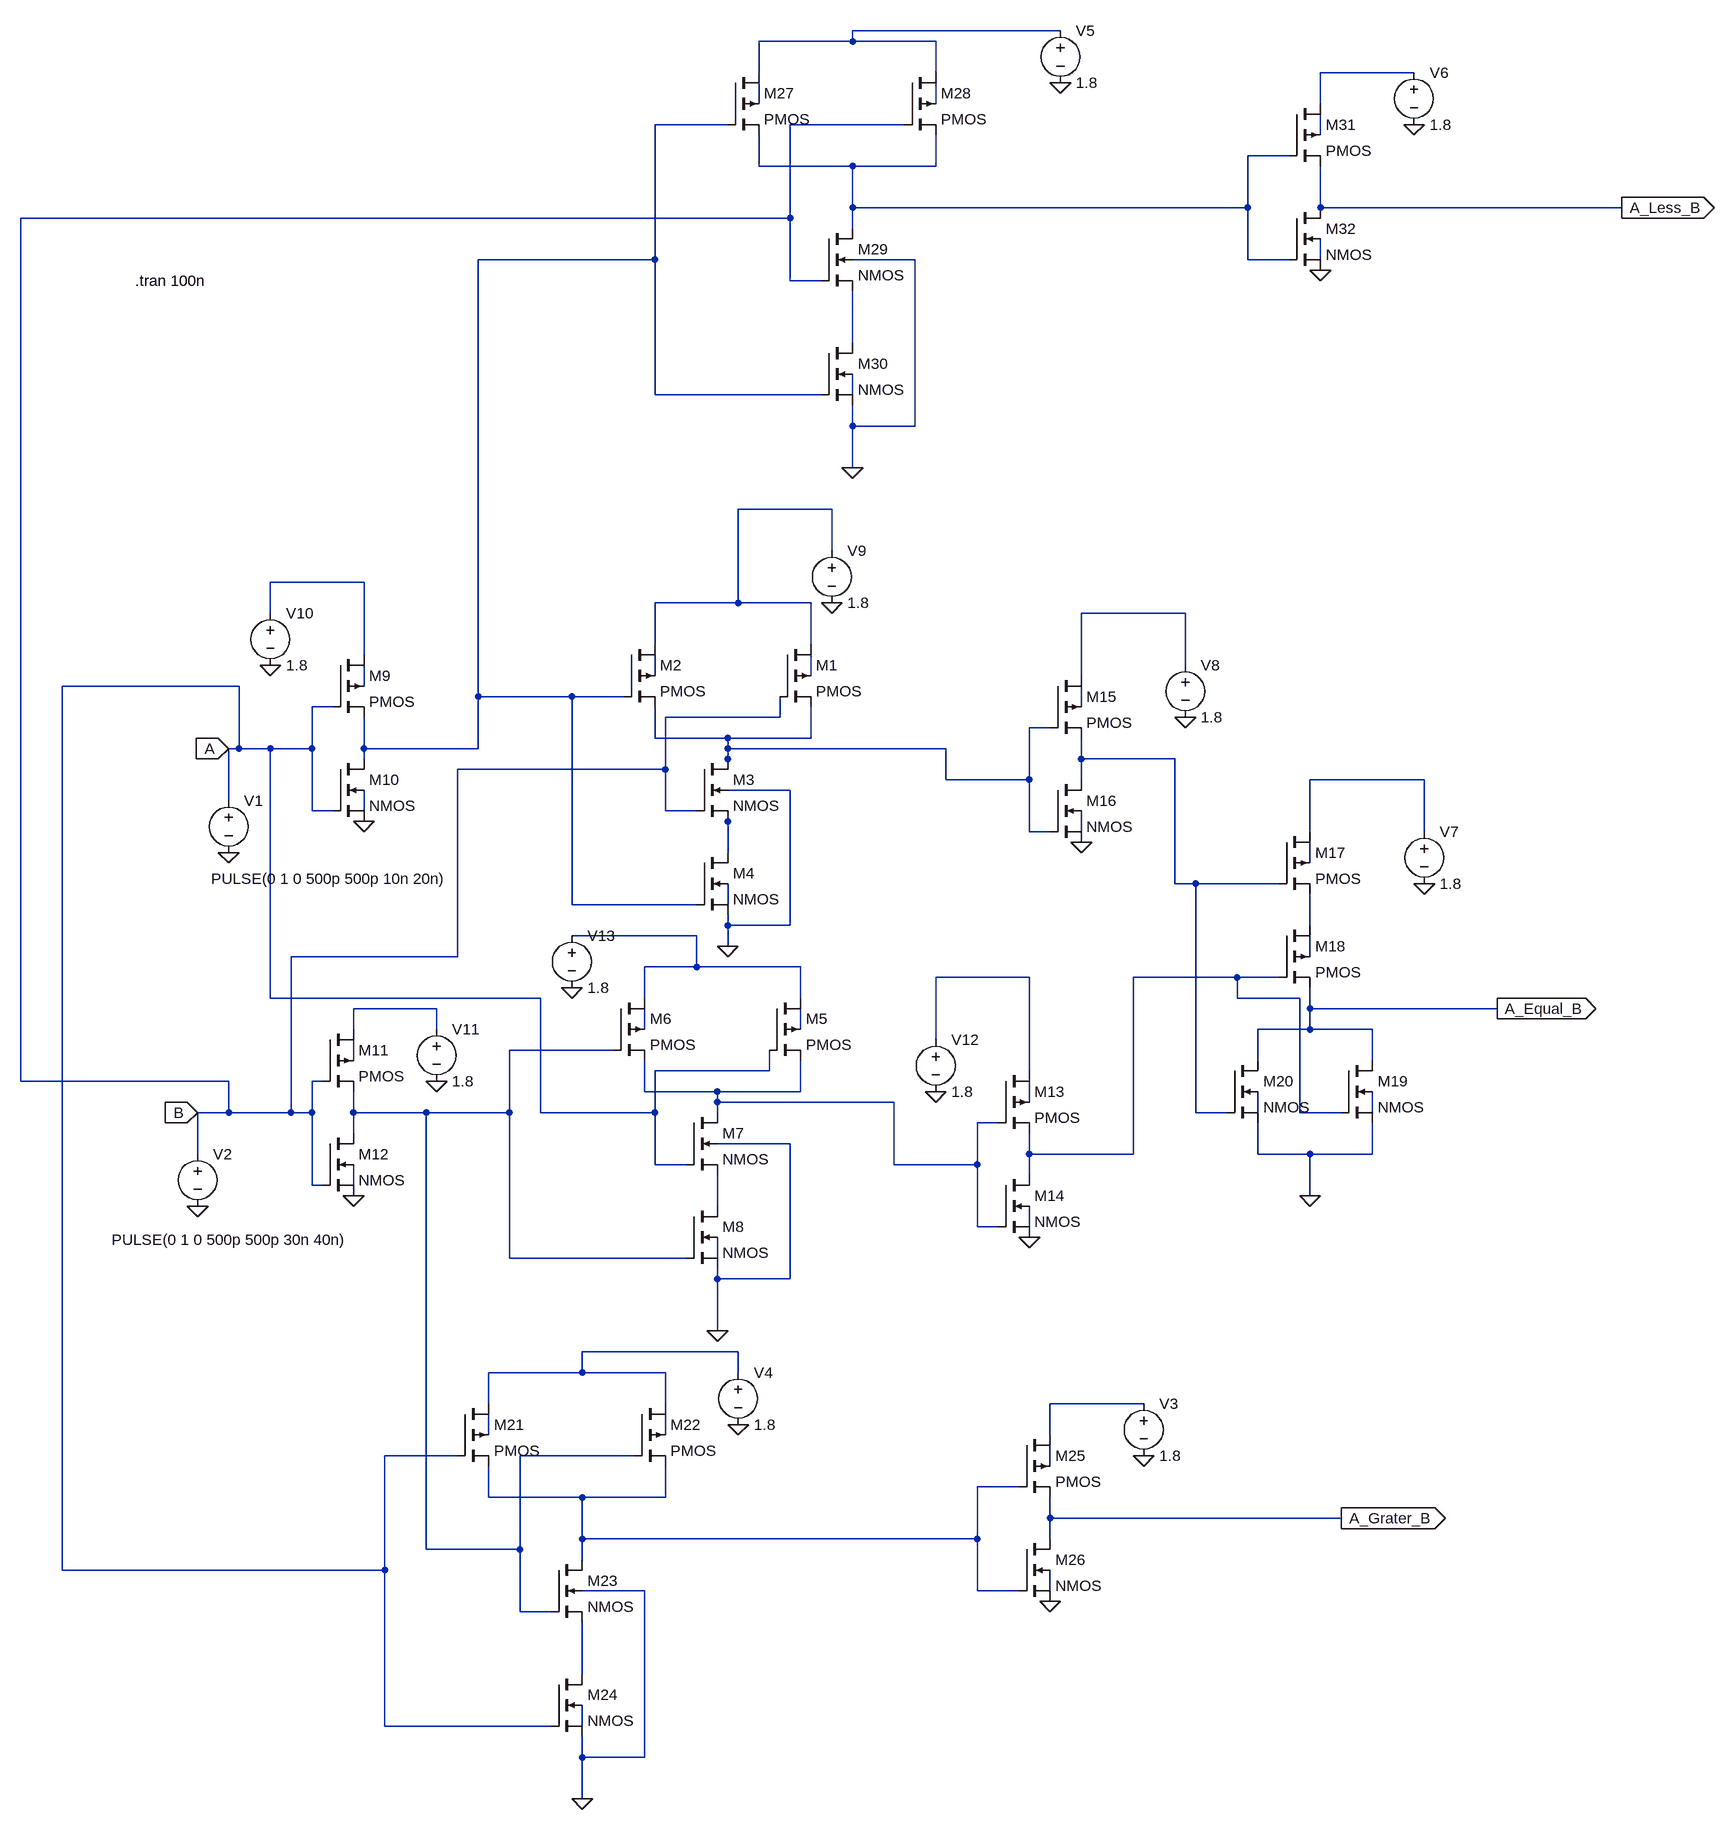
[diagram p0: schematic comparator.asc]
comparator.asc, the LTspice schematic file:
Version 4.1
SHEET 1 1784 1796
WIRE 672 -1056 352 -1056
WIRE 352 -1040 352 -1056
WIRE 352 -1040 208 -1040
WIRE 480 -1040 352 -1040
WIRE 208 -992 208 -1040
WIRE 480 -992 480 -1040
WIRE 1216 -992 1072 -992
WIRE 208 -944 208 -976
WIRE 480 -944 480 -976
WIRE 1072 -944 1072 -992
WIRE 160 -912 48 -912
WIRE 432 -912 256 -912
WIRE 1072 -896 1072 -928
WIRE 1024 -864 960 -864
WIRE 208 -848 208 -896
WIRE 352 -848 208 -848
WIRE 480 -848 480 -896
WIRE 480 -848 352 -848
WIRE 352 -784 352 -848
WIRE 960 -784 960 -864
WIRE 960 -784 352 -784
WIRE 1072 -784 1072 -848
WIRE 1536 -784 1072 -784
WIRE 256 -768 256 -912
WIRE 256 -768 -928 -768
WIRE 352 -752 352 -784
WIRE 48 -704 48 -912
WIRE 48 -704 -224 -704
WIRE 448 -704 352 -704
WIRE 960 -704 960 -784
WIRE 1024 -704 960 -704
WIRE 1072 -704 1072 -736
WIRE 256 -672 256 -768
WIRE 304 -672 256 -672
WIRE 352 -576 352 -656
WIRE 48 -496 48 -704
WIRE 304 -496 48 -496
WIRE 352 -496 352 -528
WIRE 352 -448 352 -480
WIRE 448 -448 448 -704
WIRE 448 -448 352 -448
WIRE 352 -384 352 -448
WIRE 320 -320 176 -320
WIRE 320 -256 320 -320
WIRE -400 -208 -544 -208
WIRE 176 -176 176 -320
WIRE 176 -176 48 -176
WIRE 288 -176 176 -176
WIRE -544 -160 -544 -208
WIRE 864 -160 704 -160
WIRE 48 -112 48 -176
WIRE 288 -112 288 -176
WIRE -400 -96 -400 -208
WIRE 864 -80 864 -160
WIRE 48 -64 48 -96
WIRE 288 -64 288 -96
WIRE 704 -64 704 -160
WIRE -592 -48 -864 -48
WIRE -400 -48 -400 -80
WIRE -224 -32 -224 -704
WIRE -80 -32 -224 -32
WIRE 0 -32 -80 -32
WIRE -448 -16 -480 -16
WIRE 704 -16 704 -48
WIRE 240 0 240 -32
WIRE 240 0 64 0
WIRE 656 16 624 16
WIRE 48 32 48 -16
WIRE 160 32 48 32
WIRE 288 32 288 -16
WIRE 288 32 160 32
WIRE -592 48 -592 -48
WIRE -592 48 -608 48
WIRE -544 48 -592 48
WIRE -480 48 -480 -16
WIRE -480 48 -544 48
WIRE -400 48 -400 0
WIRE -224 48 -224 -32
WIRE -224 48 -400 48
WIRE 160 48 160 32
WIRE 496 48 160 48
WIRE -400 64 -400 48
WIRE 160 64 160 48
WIRE 704 64 704 32
WIRE 848 64 704 64
WIRE 64 80 64 0
WIRE 64 80 -256 80
WIRE 160 80 160 64
WIRE 496 96 496 48
WIRE 624 96 624 16
WIRE 624 96 496 96
WIRE 704 96 704 64
WIRE 1232 96 1056 96
WIRE 256 112 160 112
WIRE -608 128 -608 48
WIRE -480 144 -480 48
WIRE -448 144 -480 144
WIRE -400 144 -400 112
WIRE 64 144 64 80
WIRE 112 144 64 144
WIRE 160 160 160 144
WIRE 624 176 624 96
WIRE 656 176 624 176
WIRE 704 176 704 144
WIRE 1056 176 1056 96
WIRE 1232 176 1232 96
WIRE 160 208 160 160
WIRE 1056 224 1056 192
WIRE 848 256 848 64
WIRE 880 256 848 256
WIRE 1008 256 880 256
WIRE -80 288 -80 -32
WIRE 112 288 -80 288
WIRE 160 288 160 256
WIRE 160 320 160 304
WIRE 256 320 256 112
WIRE 256 320 160 320
WIRE 1056 320 1056 272
WIRE 112 336 -80 336
WIRE 160 352 160 320
WIRE -256 368 -256 80
WIRE -256 368 -512 368
WIRE 1056 368 1056 336
WIRE 112 384 112 336
WIRE 112 384 32 384
WIRE 272 384 112 384
WIRE 624 400 480 400
WIRE 944 400 784 400
WIRE 1008 400 944 400
WIRE -544 432 -544 48
WIRE -128 432 -544 432
WIRE 32 432 32 384
WIRE 272 432 272 384
WIRE 944 432 944 400
WIRE 1040 432 944 432
WIRE -288 448 -416 448
WIRE 1056 448 1056 416
WIRE 1344 448 1056 448
WIRE -416 480 -416 448
WIRE -288 480 -288 448
WIRE 32 480 32 448
WIRE 272 480 272 448
WIRE 1056 480 1056 448
WIRE 1056 480 976 480
WIRE 1152 480 1056 480
WIRE 480 496 480 400
WIRE -16 512 -176 512
WIRE -416 528 -416 496
WIRE 976 528 976 480
WIRE 1152 528 1152 480
WIRE 224 544 224 512
WIRE 224 544 48 544
WIRE 624 544 624 400
WIRE -928 560 -928 -768
WIRE -608 560 -928 560
WIRE -464 560 -480 560
WIRE 32 576 32 528
WIRE 144 576 32 576
WIRE 272 576 272 528
WIRE 272 576 144 576
WIRE 144 592 144 576
WIRE 416 592 144 592
WIRE 624 592 624 560
WIRE -608 608 -608 560
WIRE -608 608 -656 608
WIRE -512 608 -512 368
WIRE -512 608 -608 608
WIRE -480 608 -480 560
WIRE -480 608 -512 608
WIRE -416 608 -416 576
WIRE -304 608 -416 608
WIRE -176 608 -176 512
WIRE -176 608 -304 608
WIRE -128 608 -128 432
WIRE 48 608 48 544
WIRE 48 608 -128 608
WIRE 144 608 144 592
WIRE 880 608 880 256
WIRE 928 608 880 608
WIRE 976 608 976 576
WIRE 1040 608 1040 432
WIRE 1104 608 1040 608
WIRE 1152 608 1152 576
WIRE 576 624 544 624
WIRE -416 640 -416 608
WIRE 256 656 144 656
WIRE -656 672 -656 608
WIRE 624 672 624 640
WIRE 784 672 784 400
WIRE 784 672 624 672
WIRE 976 672 976 624
WIRE 1056 672 976 672
WIRE 1152 672 1152 624
WIRE 1152 672 1056 672
WIRE 48 688 48 608
WIRE 96 688 48 688
WIRE 416 688 416 592
WIRE 544 688 544 624
WIRE 544 688 416 688
WIRE 624 704 624 672
WIRE -480 720 -480 608
WIRE -464 720 -480 720
WIRE -416 720 -416 688
WIRE 1056 736 1056 672
WIRE 144 752 144 704
WIRE 544 784 544 688
WIRE 576 784 544 784
WIRE 624 784 624 752
WIRE -176 832 -176 608
WIRE 96 832 -176 832
WIRE 144 832 144 800
WIRE 144 864 144 848
WIRE 256 864 256 656
WIRE 256 864 144 864
WIRE 144 944 144 864
WIRE 176 976 -64 976
WIRE -64 1008 -64 976
WIRE -64 1008 -208 1008
WIRE 64 1008 -64 1008
WIRE 176 1008 176 976
WIRE -208 1056 -208 1008
WIRE 64 1056 64 1008
WIRE 800 1056 656 1056
WIRE -208 1104 -208 1072
WIRE 64 1104 64 1072
WIRE 656 1104 656 1056
WIRE -256 1136 -368 1136
WIRE 16 1136 -160 1136
WIRE 656 1152 656 1120
WIRE 608 1184 544 1184
WIRE -208 1200 -208 1152
WIRE -64 1200 -208 1200
WIRE 64 1200 64 1152
WIRE 64 1200 -64 1200
WIRE 656 1232 656 1200
WIRE 1104 1232 656 1232
WIRE -64 1264 -64 1200
WIRE 544 1264 544 1184
WIRE 544 1264 -64 1264
WIRE 656 1264 656 1232
WIRE -304 1280 -304 608
WIRE -160 1280 -160 1136
WIRE -160 1280 -304 1280
WIRE -64 1296 -64 1264
WIRE -864 1312 -864 -48
WIRE -368 1312 -368 1136
WIRE -368 1312 -864 1312
WIRE 32 1344 -64 1344
WIRE 544 1344 544 1264
WIRE 608 1344 544 1344
WIRE 656 1344 656 1312
WIRE -160 1376 -160 1280
WIRE -112 1376 -160 1376
WIRE -64 1472 -64 1392
WIRE -368 1552 -368 1312
WIRE -112 1552 -368 1552
WIRE -64 1552 -64 1520
WIRE -64 1600 -64 1568
WIRE 32 1600 32 1344
WIRE 32 1600 -64 1600
WIRE -64 1664 -64 1600
FLAG 160 352 0
FLAG 144 944 0
FLAG -416 736 0
FLAG -400 160 0
FLAG 624 800 0
FLAG 704 192 0
FLAG 1056 736 0
FLAG -608 208 0
FLAG -656 752 0
FLAG -608 48 A
IOPIN -608 48 In
FLAG -656 608 B
IOPIN -656 608 In
FLAG 1344 448 A_Equal_B
IOPIN 1344 448 Out
FLAG 352 -384 0
FLAG 672 -976 0
FLAG 1536 -784 A_Less_B
IOPIN 1536 -784 Out
FLAG 1072 -688 0
FLAG 1216 -912 0
FLAG 1232 256 0
FLAG 864 0 0
FLAG 320 -176 0
FLAG -544 -80 0
FLAG -288 560 0
FLAG 480 576 0
FLAG -80 416 0
FLAG -64 1664 0
FLAG 656 1360 0
FLAG 800 1136 0
FLAG 176 1088 0
FLAG 1104 1232 A_Grater_B
IOPIN 1104 1232 Out
SYMBOL pmos4 240 -112 R0
SYMATTR InstName M1
SYMBOL pmos4 0 -112 R0
SYMATTR InstName M2
SYMBOL nmos4 112 64 R0
SYMATTR InstName M3
SYMBOL nmos4 112 208 R0
SYMATTR InstName M4
SYMBOL pmos4 224 432 R0
SYMATTR InstName M5
SYMBOL pmos4 -16 432 R0
SYMATTR InstName M6
SYMBOL nmos4 96 608 R0
SYMATTR InstName M7
SYMBOL nmos4 96 752 R0
SYMATTR InstName M8
SYMBOL pmos4 -448 -96 R0
SYMATTR InstName M9
SYMBOL nmos4 -448 64 R0
SYMATTR InstName M10
SYMBOL pmos4 -464 480 R0
SYMATTR InstName M11
SYMBOL nmos4 -464 640 R0
SYMATTR InstName M12
SYMBOL pmos4 576 544 R0
SYMATTR InstName M13
SYMBOL nmos4 576 704 R0
SYMATTR InstName M14
SYMBOL pmos4 656 -64 R0
SYMATTR InstName M15
SYMBOL nmos4 656 96 R0
SYMATTR InstName M16
SYMBOL pmos4 1008 176 R0
SYMATTR InstName M17
SYMBOL pmos4 1008 320 R0
SYMATTR InstName M18
SYMBOL nmos4 1104 528 R0
SYMATTR InstName M19
SYMBOL nmos4 928 528 R0
SYMATTR InstName M20
SYMBOL voltage -608 112 R0
WINDOW 3 -27 136 Left 2
WINDOW 123 0 0 Left 0
WINDOW 39 0 0 Left 0
SYMATTR Value PULSE(0 1 0 500p 500p 10n 20n)
SYMATTR InstName V1
SYMBOL voltage -656 656 R0
WINDOW 3 -132 148 Left 2
WINDOW 123 0 0 Left 0
WINDOW 39 0 0 Left 0
SYMATTR Value PULSE(0 1 0 500p 500p 30n 40n)
SYMATTR InstName V2
SYMBOL pmos4 160 -992 R0
SYMATTR InstName M27
SYMBOL pmos4 432 -992 R0
SYMATTR InstName M28
SYMBOL nmos4 304 -752 R0
SYMATTR InstName M29
SYMBOL nmos4 304 -576 R0
SYMATTR InstName M30
SYMBOL voltage 672 -1072 R0
WINDOW 123 0 0 Left 0
WINDOW 39 0 0 Left 0
SYMATTR InstName V5
SYMATTR Value 1.8
SYMBOL pmos4 1024 -944 R0
SYMATTR InstName M31
SYMBOL nmos4 1024 -784 R0
SYMATTR InstName M32
SYMBOL voltage 1216 -1008 R0
WINDOW 123 0 0 Left 0
WINDOW 39 0 0 Left 0
SYMATTR InstName V6
SYMATTR Value 1.8
SYMBOL voltage 1232 160 R0
WINDOW 123 0 0 Left 0
WINDOW 39 0 0 Left 0
SYMATTR InstName V7
SYMATTR Value 1.8
SYMBOL voltage 864 -96 R0
WINDOW 123 0 0 Left 0
WINDOW 39 0 0 Left 0
SYMATTR InstName V8
SYMATTR Value 1.8
SYMBOL voltage 320 -272 R0
WINDOW 123 0 0 Left 0
WINDOW 39 0 0 Left 0
SYMATTR InstName V9
SYMATTR Value 1.8
SYMBOL voltage -544 -176 R0
WINDOW 123 0 0 Left 0
WINDOW 39 0 0 Left 0
SYMATTR InstName V10
SYMATTR Value 1.8
SYMBOL voltage -288 464 R0
WINDOW 123 0 0 Left 0
WINDOW 39 0 0 Left 0
SYMATTR InstName V11
SYMATTR Value 1.8
SYMBOL voltage 480 480 R0
WINDOW 123 0 0 Left 0
WINDOW 39 0 0 Left 0
SYMATTR InstName V12
SYMATTR Value 1.8
SYMBOL voltage -80 320 R0
WINDOW 123 0 0 Left 0
WINDOW 39 0 0 Left 0
SYMATTR InstName V13
SYMATTR Value 1.8
SYMBOL pmos4 -256 1056 R0
SYMATTR InstName M21
SYMBOL pmos4 16 1056 R0
SYMATTR InstName M22
SYMBOL nmos4 -112 1296 R0
SYMATTR InstName M23
SYMBOL nmos4 -112 1472 R0
SYMATTR InstName M24
SYMBOL pmos4 608 1104 R0
SYMATTR InstName M25
SYMBOL nmos4 608 1264 R0
SYMATTR InstName M26
SYMBOL voltage 800 1040 R0
WINDOW 123 0 0 Left 0
WINDOW 39 0 0 Left 0
SYMATTR InstName V3
SYMATTR Value 1.8
SYMBOL voltage 176 992 R0
WINDOW 123 0 0 Left 0
WINDOW 39 0 0 Left 0
SYMATTR InstName V4
SYMATTR Value 1.8
TEXT -752 -672 Left 2 !.tran 100n

The netlist it stands for:
* comparator.asc
M1 N011 B N018 N015 PMOS
M2 N011 N005 N018 N014 PMOS
M3 N018 B N022 0 NMOS
M4 N022 N005 0 N025 NMOS
M5 N027 A N036 N033 PMOS
M6 N027 N034 N036 N032 PMOS
M7 N036 A N041 0 NMOS
M8 N041 N034 0 N043 NMOS
M9 N012 A N005 N016 PMOS
M10 N005 A 0 N021 NMOS
M11 N031 B N034 N035 PMOS
M12 N034 B 0 N040 NMOS
M13 N029 N036 N030 N037 PMOS
M14 N030 N036 0 N042 NMOS
M15 N013 N018 N019 N017 PMOS
M16 N019 N018 0 N023 NMOS
M17 N020 N019 N026 N024 PMOS
M18 N026 N030 A_Equal_B N028 PMOS
M19 A_Equal_B N030 0 N039 NMOS
M20 A_Equal_B N019 0 N038 NMOS
V1 A 0 PULSE(0 1 0 500p 500p 10n 20n)
V2 B 0 PULSE(0 1 0 500p 500p 30n 40n)
M27 N001 N005 N007 N003 PMOS
M28 N001 B N007 N004 PMOS
M29 N007 B N009 0 NMOS
M30 N009 N005 0 N010 NMOS
V5 N001 0 1.8
M31 N002 N007 A_Less_B N006 PMOS
M32 A_Less_B N007 0 N008 NMOS
V6 N002 0 1.8
V7 N020 0 1.8
V8 N013 0 1.8
V9 N011 0 1.8
V10 N012 0 1.8
V11 N031 0 1.8
V12 N029 0 1.8
V13 N027 0 1.8
M21 N044 A N049 N046 PMOS
M22 N044 N034 N049 N047 PMOS
M23 N049 N034 N051 0 NMOS
M24 N051 A 0 N052 NMOS
M25 N045 N049 A_Grater_B N048 PMOS
M26 A_Grater_B N049 0 N050 NMOS
V3 N045 0 1.8
V4 N044 0 1.8
.model NMOS NMOS
.model PMOS PMOS
.lib standard.mos
.tran 100n
.backanno
.end